# EAGLE design SSRBoard_v10 (EAGLE 5.11)
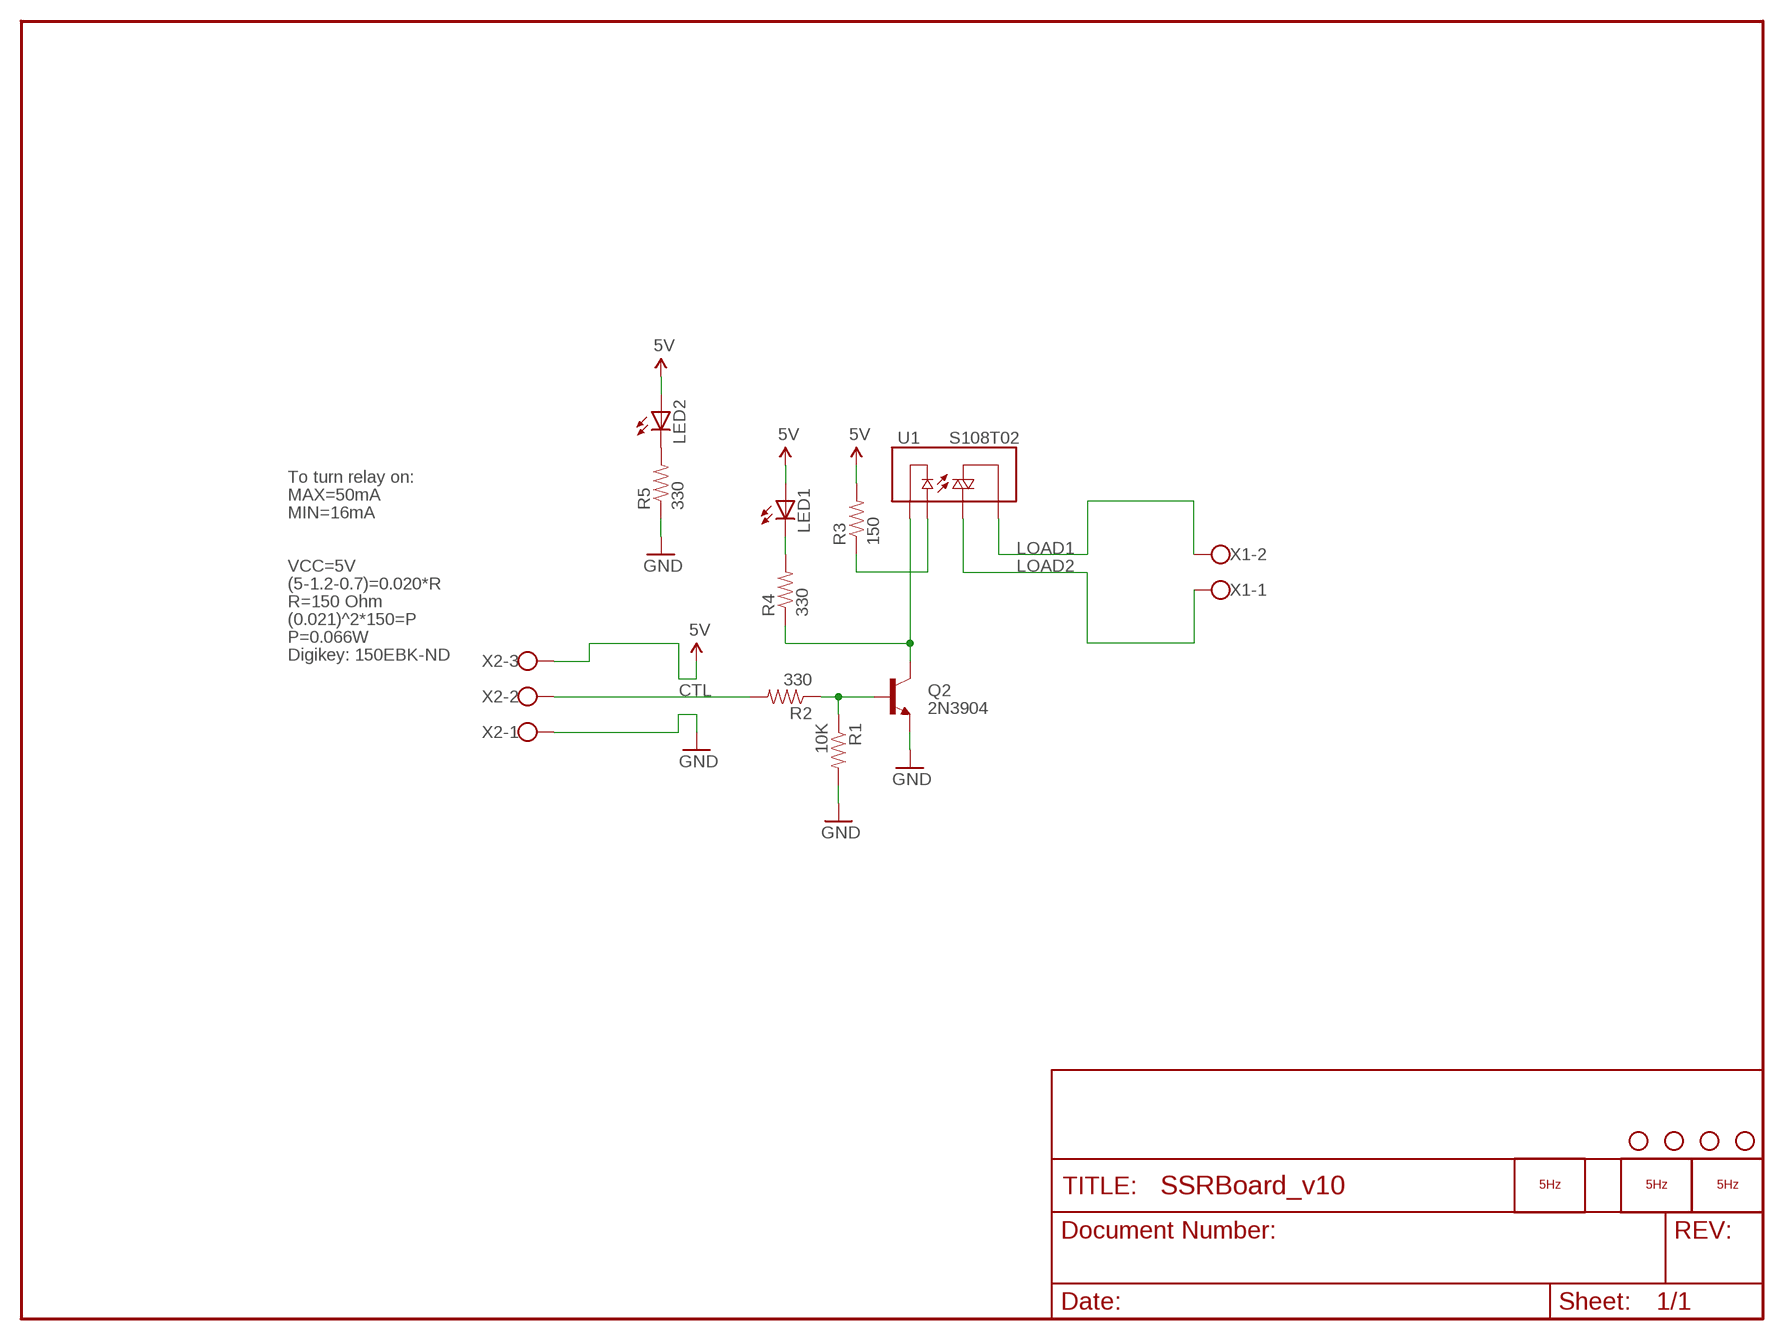
[diagram p0: schematic, sheet 1]

## Parts
LED1  LED0603  [LED-0603]
LED2  LED0603  [LED-0603]
LOGO1  LOGO_5HZ_H_15MM  [5HZ_LOGO_H_15MM]
LOGO2  LOGO_5HZ_WEB_COOPER_10MM  [5HZ_WEB_COOPER_10MM]
LOGO4  LOGO_5HZ_CIRC_COOPER_5MM  [5HZ_LOGO_CIRC_COOPER_5MM]
Q2  2N3904  TRANSISTOR_NPNSOT23  [SOT23]
R1  10K  RESISTOR0603-RES  [0603-RES]
R2  330  RESISTOR0603-RES  [0603-RES]
R3  150  RESISTOR0603-RES  [0603-RES]
R4  330  RESISTOR0603-RES  [0603-RES]
R5  330  RESISTOR0603-RES  [0603-RES]
U1  S108T02  RELAY-SOLIDSTATEPTH  [RELAY-S108T02]
U$3  STAND-OFF  [STAND-OFF]
U$4  STAND-OFF  [STAND-OFF]
U$5  STAND-OFF  [STAND-OFF]
U$7  STAND-OFF  [STAND-OFF]
X1  W237-102  [W237-102]
X2  W237-103  [W237-103]

## Nets
5V: LED1.A LED2.A R3.2 X2.3
COIL: Q2.3(C) R4.1 U1.4(-)
CTL: R2.2 X2.2
GND: Q2.2(E) R1.2 R5.1 X2.1
LOAD1: U1.1(T1) X1.2
LOAD2: U1.2(T2) X1.1
N$1: R3.1 U1.3(+)
N$4: LED2.C R5.2
N$6: Q2.1(B) R1.1 R2.1
N$9: LED1.C R4.2

## Notes on the sheet
- To turn relay on:
- MAX=50mA
- MIN=16mA
- VCC=5V
- (5-1.2-0.7)=0.020*R
- R=150 Ohm
- (0.021)^2*150=P
- P=0.066W
- Digikey: 150EBK-ND

## Library data of the parts
LED1 LED2 = SparkFun:LED: LEDs Standard schematic elements and footprints for 5mm, 3mm, 1206, and 0603 sized LEDs. 5mm - Spark Fun Electronics SKU : COM-00529 (and others)
LOGO1 LOGO2 LOGO4 = 5hz-electronica:LOGO_5HZ: Logotipo 5Hz "según Pedro"
Q2 = SparkFun:TRANSISTOR_NPN: Transistor NPN BJT configuration in SOT23 package. MMBT2222 is the common NPN we use. Double check BCE configuration again layout.
R1-R5 = SparkFun:RESISTOR: Resistor Basic schematic elements and footprints for 0603, 1206, and PTH resistors.
U1 = SparkFun:RELAY-SOLIDSTATE
U$3-U$5 U$7 = SparkFun:STAND-OFF: Stand Off This is the mechanical footprint for a #4 phillips button head screw. Use the keepout ring to avoid running the screw head into surrounding components. SKU : PRT-00447
X1 = con-wago-500:W237-102: WAGO SCREW CLAMP; MPN: 237-102; OC_FARNELL: unknown; OC_NEWARK: 70K9898
X2 = con-wago-500:W237-103: WAGO SCREW CLAMP; MPN: 237-103; OC_FARNELL: unknown; OC_NEWARK: 18M7116

## Board
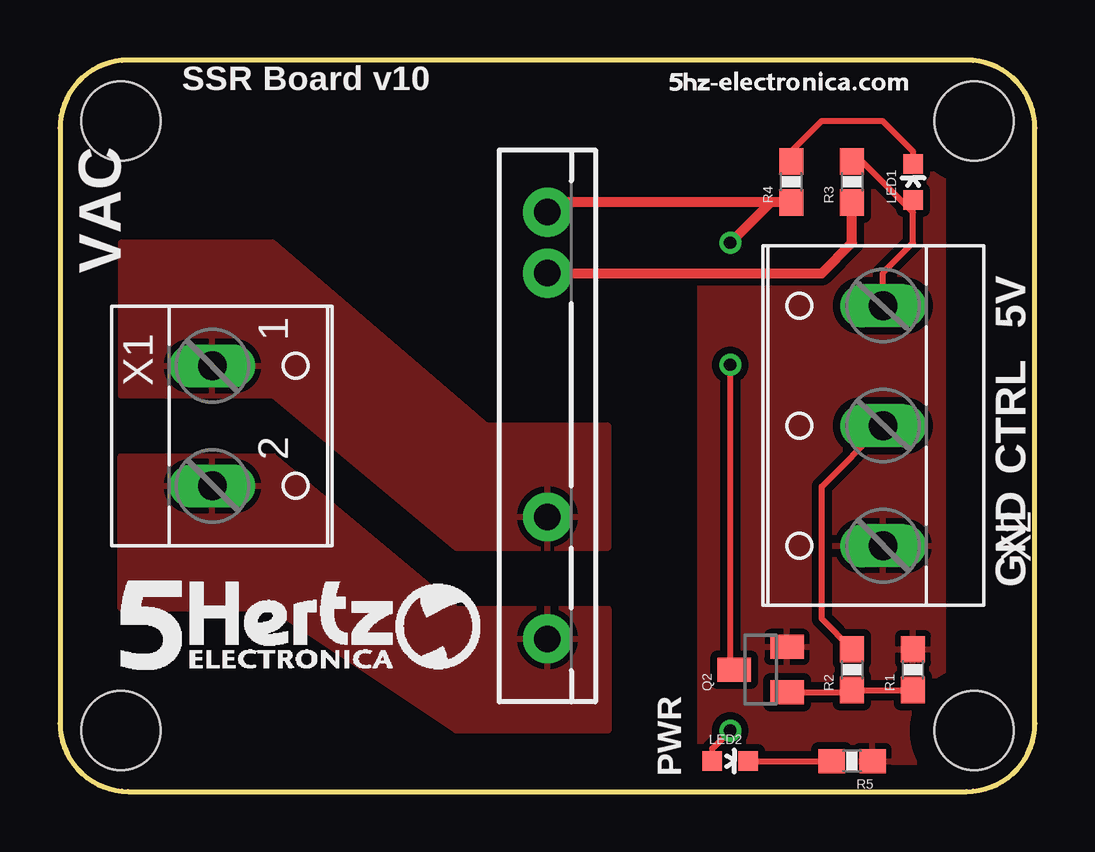
[diagram p1: board, top side]
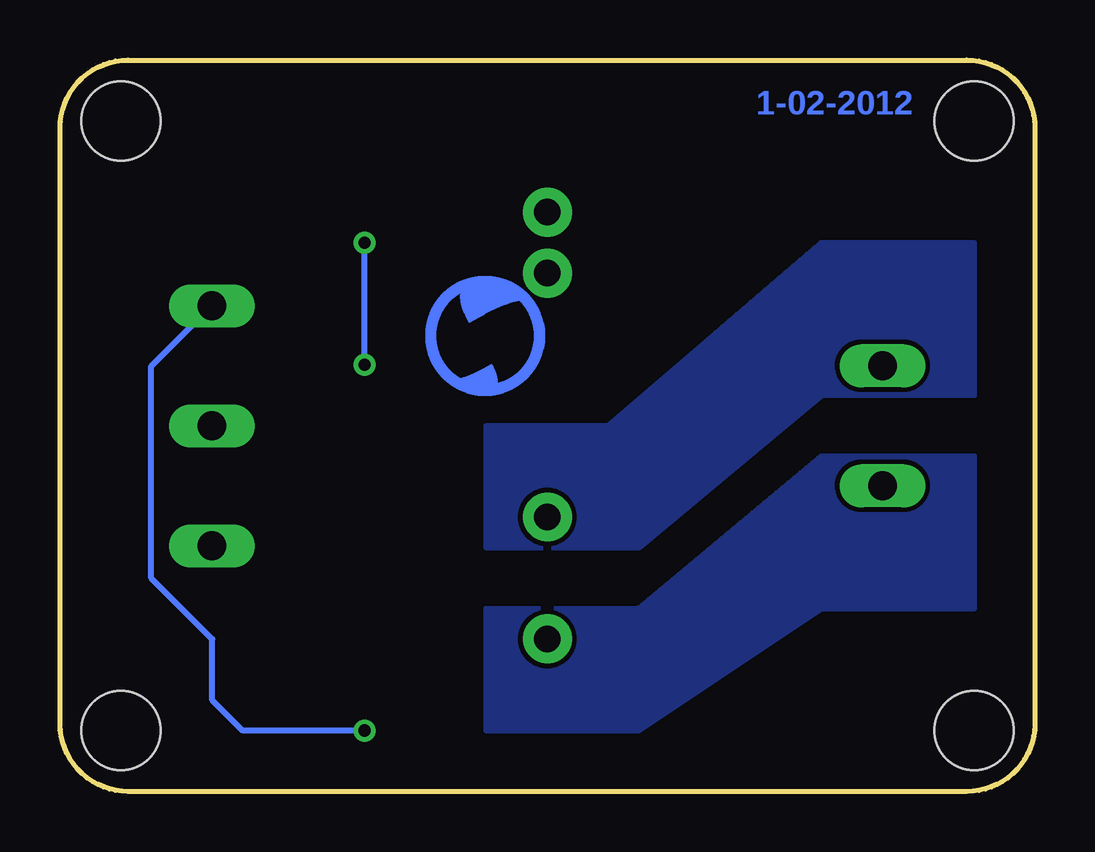
[diagram p2: board, bottom side, seen from below]

Size 40.64 x 30.48 mm. Coordinates in mm from the lower left corner, seen from the top.
Outline: 37.8,0 arc90 40.64,2.84 40.64,27.64 arc90 37.8,30.48 2.84,30.48 arc90 0,27.64 0,2.84 arc90 2.84,0 37.8,0
Copper layers (1*16): Top 0.035mm / dielectric 1.5mm / Bottom 0.035mm
Design rules: minimum track width 10mil, minimum drill 24mil, track to track 8mil, track to pad 8mil, pad to pad 8mil, via to via 8mil, smd to smd 8mil, copper to edge 40mil, drill to drill 8mil, minimum pad ring 10mil, minimum via ring 8mil, stop-mask expansion 4mil, vias tented up to drill 0mil, thermal gap 10mil

### Footprints (pad centres in the part's own frame; a part is rotated, then mirrored left to right if it is on the bottom)
LED-0603 = smd 0.8 x 0.8: A 0,-0.75; C 0,0.75
SOT23 = smd 1 x 1.4: 1 -0.95,-1.1; 2 0.95,-1.1; 3 0,1.1
0603-RES = smd 1.1 x 1: 1 -0.85,0; 2 0.85,0
RELAY-S108T02 = drill 1.1 pad 2.032: 1 -8.88,0; 2 -3.8,0; 3 6.36,0; 4 8.9,0
STAND-OFF = hole 3.302: 0,0
W237-102 = drill 1.194 long: 1 -2.5,-1.27; 2 2.5,-1.27
W237-103 = drill 1.194 long: 1 -5,-1.29; 2 0,-1.29; 3 5,-1.29

### Placement (x,y rotation side)
LED1  35.56,25.4 0 top
LED2  27.94,1.27 270 top
LOGO1  2.54,5.08 0 top
LOGO2  25.4,29.21 0 top
LOGO4  25.4,16.51 0 bottom
Q2  29.21,5.08 90 top
R1  35.56,5.08 90 top
R2  33.02,5.08 90 top
R3  33.02,25.4 90 top
R4  30.48,25.4 90 top
R5  33.02,1.27 180 top
U1  20.32,15.24 90 top
U$3  2.54,2.54 0 top
U$4  38.1,27.94 0 top
U$5  2.54,27.94 0 top
U$7  38.1,2.54 0 top
X1  7.62,15.24 270 top
X2  33.02,15.24 90 top

### Tracks (layer width: path | path; a pad name or v marks a point on that pad's centre or on a via)
5V  (via drill 0.51)
  Top 0.254: X2.3 34.31,21.61 35.56,22.86 35.56,24.13 | 35.56,24.13 LED1.A | R3.2 33.44,26.25 35.56,24.13 | LED2.A 27.19,1.79 v27.94,2.54
  Bottom 0.254: v27.94,2.54 33.02,2.54 34.29,3.81 34.29,6.35 36.83,8.89 36.83,17.72 X2.3
COIL  (via drill 0.51)
  Top 0.254: 29.63,24.55 R4.1 | v27.94,17.78 27.94,5.25 Q2.3
  Top 0.406: R4.1 20.73,24.55 U1.4 | v27.94,22.86 29.63,24.55
  Bottom 0.254: v27.94,17.78 v27.94,22.86
CTL
  Top 0.254: X2.2 34.29,15.24 31.75,12.7 31.75,7.2 R2.2
GND
  pour Top (isolate 0.305): 36.83,27.94 26.67,27.94 26.67,0 36.83,0
LOAD1
  pour Top: 2.54,13.97 8.89,13.97 16.51,7.62 22.86,7.62 22.86,2.54 16.51,2.54 8.89,7.62 2.54,7.62
LOAD2
  pour Top: 2.54,22.86 2.54,16.51 8.89,16.51 16.51,10.16 22.86,10.16 22.86,15.24 17.78,15.24 8.89,22.86
N$1
  Top 0.254: U1.3
  Top 0.406: R3.1 33.02,22.86 31.75,21.59 U1.3
N$2
  pour Bottom: 2.54,22.86 2.54,16.51 8.89,16.51 16.51,10.16 22.86,10.16 22.86,15.24 17.78,15.24 8.89,22.86
N$3
  pour Bottom: 2.54,13.97 2.54,7.62 8.89,7.62 16.51,2.54 22.86,2.54 22.86,7.62 16.51,7.62 8.89,13.97
N$4
  Top 0.254: LED2.C R5.2
N$6
  Top 0.254: 35.56,3.81 R1.1 R2.1 32.92,4.13 Q2.1
N$9
  Top 0.254: LED1.C 35.56,26.67 34.29,27.94 31.75,27.94 30.48,26.67 R4.2

### Text on the board
Bottom: 1-02-2012
tPlace: SSR Board v10 | VAC | 5V | CTRL | GND | PWR